# EAGLE schematic 17 (EAGLE 9.5.2)
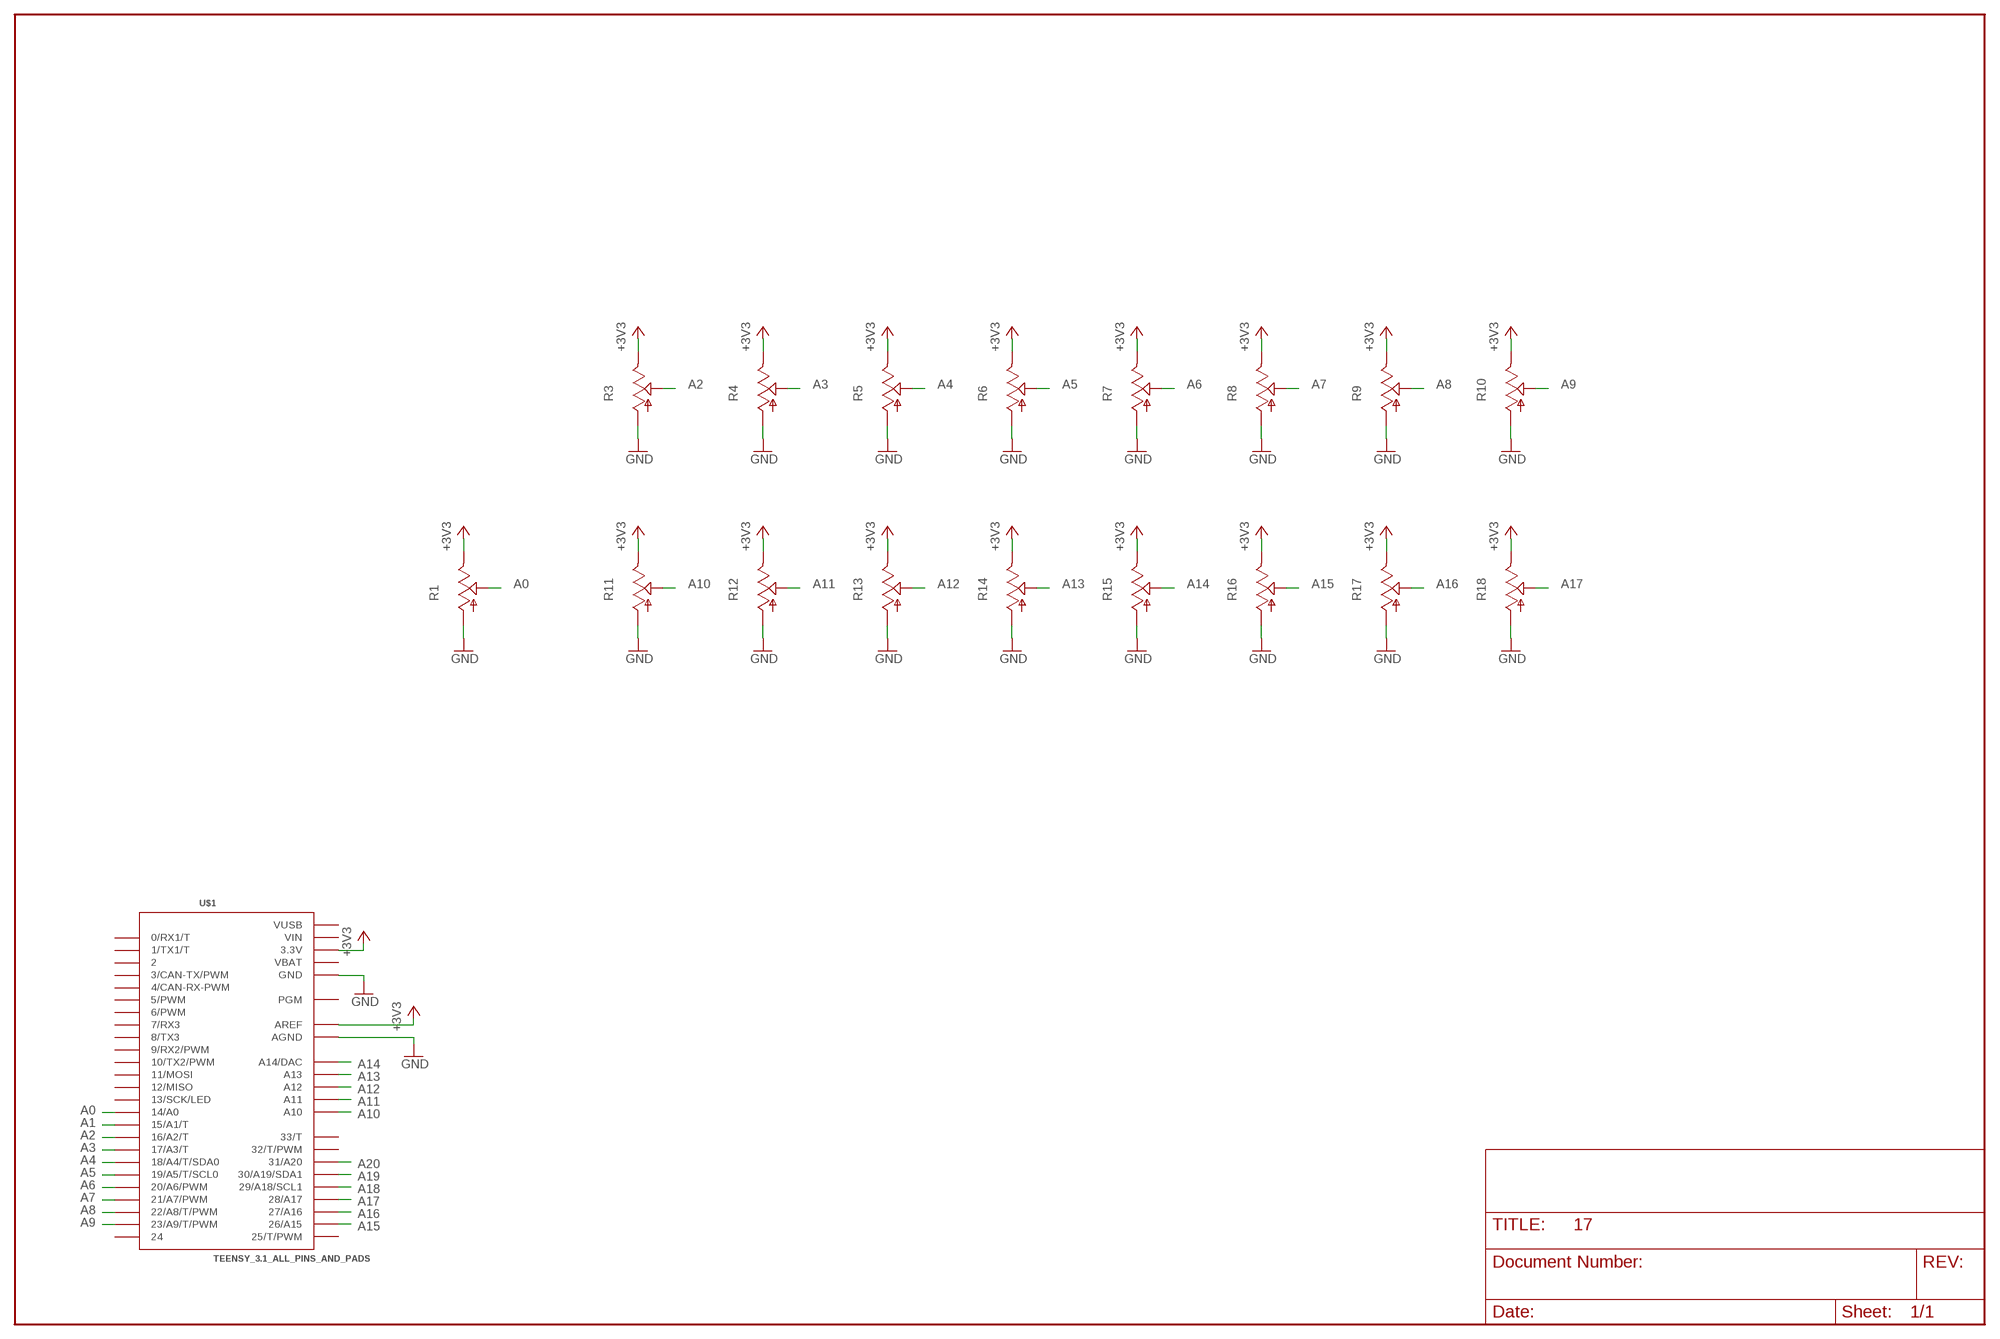
[diagram p0: schematic, sheet 1]

## Parts
R1  SHAPES_POT-ALPS_POT_USVERTICAL_PS  [SHAPES_POT-ALPS_ALPS_POT_VERTICAL_PS]
R3  SHAPES_POT-ALPS_POT_USVERTICAL_PS  [SHAPES_POT-ALPS_ALPS_POT_VERTICAL_PS]
R4  SHAPES_POT-ALPS_POT_USVERTICAL_PS  [SHAPES_POT-ALPS_ALPS_POT_VERTICAL_PS]
R5  SHAPES_POT-ALPS_POT_USVERTICAL_PS  [SHAPES_POT-ALPS_ALPS_POT_VERTICAL_PS]
R6  SHAPES_POT-ALPS_POT_USVERTICAL_PS  [SHAPES_POT-ALPS_ALPS_POT_VERTICAL_PS]
R7  SHAPES_POT-ALPS_POT_USVERTICAL_PS  [SHAPES_POT-ALPS_ALPS_POT_VERTICAL_PS]
R8  SHAPES_POT-ALPS_POT_USVERTICAL_PS  [SHAPES_POT-ALPS_ALPS_POT_VERTICAL_PS]
R9  SHAPES_POT-ALPS_POT_USVERTICAL_PS  [SHAPES_POT-ALPS_ALPS_POT_VERTICAL_PS]
R10  SHAPES_POT-ALPS_POT_USVERTICAL_PS  [SHAPES_POT-ALPS_ALPS_POT_VERTICAL_PS]
R11  SHAPES_POT-ALPS_POT_USVERTICAL_PS  [SHAPES_POT-ALPS_ALPS_POT_VERTICAL_PS]
R12  SHAPES_POT-ALPS_POT_USVERTICAL_PS  [SHAPES_POT-ALPS_ALPS_POT_VERTICAL_PS]
R13  SHAPES_POT-ALPS_POT_USVERTICAL_PS  [SHAPES_POT-ALPS_ALPS_POT_VERTICAL_PS]
R14  SHAPES_POT-ALPS_POT_USVERTICAL_PS  [SHAPES_POT-ALPS_ALPS_POT_VERTICAL_PS]
R15  SHAPES_POT-ALPS_POT_USVERTICAL_PS  [SHAPES_POT-ALPS_ALPS_POT_VERTICAL_PS]
R16  SHAPES_POT-ALPS_POT_USVERTICAL_PS  [SHAPES_POT-ALPS_ALPS_POT_VERTICAL_PS]
R17  SHAPES_POT-ALPS_POT_USVERTICAL_PS  [SHAPES_POT-ALPS_ALPS_POT_VERTICAL_PS]
R18  SHAPES_POT-ALPS_POT_USVERTICAL_PS  [SHAPES_POT-ALPS_ALPS_POT_VERTICAL_PS]
U$1  TEENSY_3.1_ALL_PINS_AND_PADS  [TEENSY_3.1_ALLPINS]

## Nets
+3V3: R1.P$1(E) R3.P$1(E) R4.P$1(E) R5.P$1(E) R6.P$1(E) R7.P$1(E) R8.P$1(E) R9.P$1(E) R10.P$1(E) R11.P$1(E) R12.P$1(E) R13.P$1(E) R14.P$1(E) R15.P$1(E) R16.P$1(E) R17.P$1(E) R18.P$1(E) U$1.3.3V U$1.3.3V1(3.3V) U$1.3.3V2(3.3V) U$1.AREF
A0: R1.P$2(S) U$1.14/A0
A1: U$1.15/A1(15/A1/T)
A2: R3.P$2(S) U$1.16/A2(16/A2/T)
A3: R4.P$2(S) U$1.17/A3(17/A3/T)
A4: R5.P$2(S) U$1.18/A4(18/A4/T/SDA0)
A5: R6.P$2(S) U$1.19/A5(19/A5/T/SCL0)
A6: R7.P$2(S) U$1.20/A6(20/A6/PWM)
A7: R8.P$2(S) U$1.21/A7(21/A7/PWM)
A8: R9.P$2(S) U$1.22/A8(22/A8/T/PWM)
A9: R10.P$2(S) U$1.23/A9(23/A9/T/PWM)
A10: R11.P$2(S) U$1.A10
A11: R12.P$2(S) U$1.A11
A12: R13.P$2(S) U$1.A12
A13: R14.P$2(S) U$1.A13
A14: R15.P$2(S) U$1.A14(A14/DAC)
A15: R16.P$2(S) U$1.26(26/A15)
A16: R17.P$2(S) U$1.27(27/A16)
A17: R18.P$2(S) U$1.28(28/A17)
A18: U$1.29(29/A18/SCL1)
A19: U$1.30(30/A19/SDA1)
A20: U$1.31(31/A20)
GND: R1.P$3(A) R3.P$3(A) R4.P$3(A) R5.P$3(A) R6.P$3(A) R7.P$3(A) R8.P$3(A) R9.P$3(A) R10.P$3(A) R11.P$3(A) R12.P$3(A) R13.P$3(A) R14.P$3(A) R15.P$3(A) R16.P$3(A) R17.P$3(A) R18.P$3(A) U$1.AGND U$1.GND U$1.GND1(GND) U$1.GND2(GND)
Unconnected: U$1.0(0/RX1/T) U$1.1(1/TX1/T) U$1.2 U$1.3(3/CAN-TX/PWM) U$1.4(4/CAN-RX-PWM) U$1.5(5/PWM) U$1.6(6/PWM) U$1.7(7/RX3) U$1.8(8/TX3) U$1.9(9/RX2/PWM) U$1.10(10/TX2/PWM) U$1.11(11/MOSI) U$1.12(12/MISO) U$1.13(13/SCK/LED) U$1.24 U$1.25(25/T/PWM) U$1.32(32/T/PWM) U$1.33(33/T) U$1.PGM

## Power pins joined to a net without a drawn wire
VBAT: U$1.VBAT
VIN: U$1.VIN
VUSB: U$1.VUSB

## Library data of the parts
R1 R3-R18 = monome_modular:SHAPES_POT-ALPS_POT_US
U$1 = Teensy_3_Series_Board_v1.0:TEENSY_3.1_ALL_PINS_AND_PADS: Footprint for Teensy 3.1 board using all pads and all through-holes. Pads need a 2x7 0.1" SMD header.